# Altium schematic sheet 电机,舵机.SchDoc
size A4
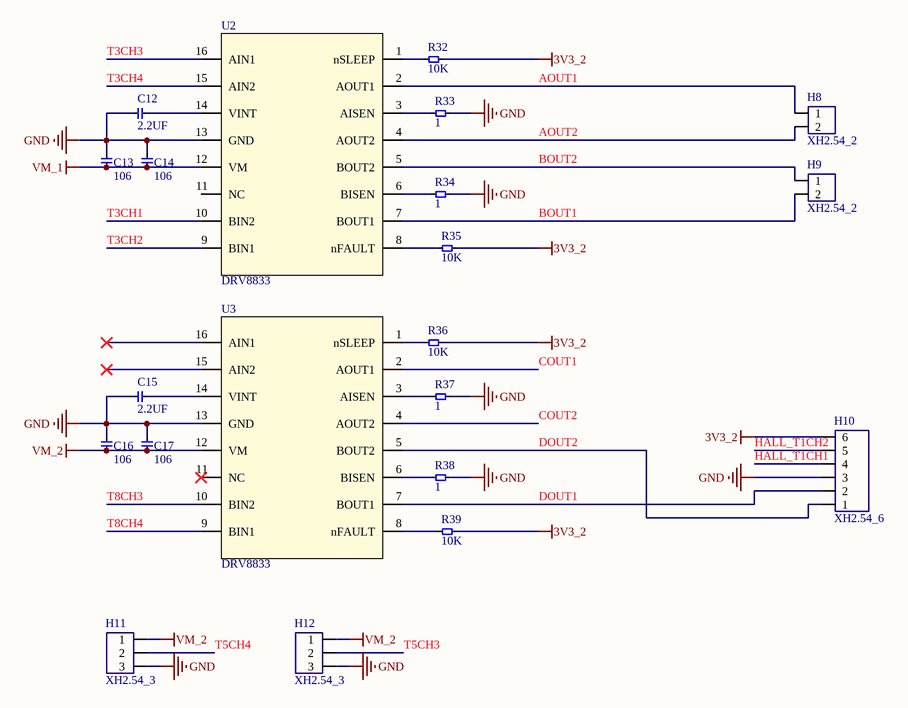
[diagram p0: 电机,舵机.SchDoc]

## Parts
C12  2.2UF  [C_0603]
C13  106  [C_0603]
C14  106  [C_0603]
C15  2.2UF  [C_0603]
C16  106  [C_0603]
C17  106  [C_0603]
H8  XH2.54_2  [H_XH2.54_2]
H9  XH2.54_2  [H_XH2.54_2]
H10  XH2.54_6  [H_XH2.54_6]
H11  XH2.54_3  [H_XH2.54_3]
H12  XH2.54_3  [H_XH2.54_3]
R32  10K  [R_0603]
R33  1  [R_1206]
R34  1  [R_1206]
R35  10K  [R_0603]
R36  10K  [R_0603]
R37  1  [R_1206]
R38  1  [R_1206]
R39  10K  [R_0603]
U2  DRV8833  [SSOP16]
U3  DRV8833  [SSOP16]

## Nets
3V3_2: H10.6 R32.2 R35.2 R36.2 R39.2
GND: C12.2 C13.2 C14.2 C15.2 C16.2 C17.2 H10.3 H11.3 H12.3 R33.2 R34.2 R37.2 R38.2 U2.13(GND) U3.13(GND)
VM_1: C13.1 C14.1 U2.12(VM)
VM_2: C16.1 C17.1 H11.1 H12.1 U3.12(VM)
AOUT1: H8.1 U2.2(AOUT1)
AOUT2: H8.2 U2.4(AOUT2)
BOUT1: H9.2 U2.7(BOUT1)
BOUT2: H9.1 U2.5(BOUT2)
COUT1: U3.2(AOUT1)
COUT2: U3.4(AOUT2)
DOUT1: H10.2 U3.7(BOUT1)
DOUT2: H10.1 U3.5(BOUT2)
HALL_T1CH1: H10.4
HALL_T1CH2: H10.5
T3CH1: U2.10(BIN2)
T3CH2: U2.9(BIN1)
T3CH3: U2.16(AIN1)
T3CH4: U2.15(AIN2)
T5CH3: H12.2
T5CH4: H11.2
T8CH3: U3.10(BIN2)
T8CH4: U3.9(BIN1)
NetC12_1: C12.1 U2.14(VINT)
NetC15_1: C15.1 U3.14(VINT)
NetR32_1: R32.1 U2.1(nSLEEP)
NetR33_1: R33.1 U2.3(AISEN)
NetR34_1: R34.1 U2.6(BISEN)
NetR35_1: R35.1 U2.8(nFAULT)
NetR36_1: R36.1 U3.1(nSLEEP)
NetR37_1: R37.1 U3.3(AISEN)
NetR38_1: R38.1 U3.6(BISEN)
NetR39_1: R39.1 U3.8(nFAULT)

Not connected (* = marked no-connect by the designer): U2 11(NC); U3 11(NC)* 15(AIN2)* 16(AIN1)*

## Library data of the parts
C12-C17 = C_无极贴片: 无极性贴片电容
H8 H9 = H_XH2.54_2: 2脚小白头; LatestRevisionDate: 17-Jul-2002; LatestRevisionNote: Re-released for DXP Platform.; Publisher: Altium Limited
H10 = H_XH2.54_6: 6脚小白头; LatestRevisionDate: 17-Jul-2002; LatestRevisionNote: Re-released for DXP Platform.; Publisher: Altium Limited
H11 H12 = H_XH2.54_3: 3脚小白头; LatestRevisionDate: 17-Jul-2002; LatestRevisionNote: Re-released for DXP Platform.; Publisher: Altium Limited
R32-R39 = R_贴片: 贴片电阻